# Altium schematic sheet TQP9111_Devboard_opt.SchDoc
size A4; SheetNumber: 4; SheetTotal: 4
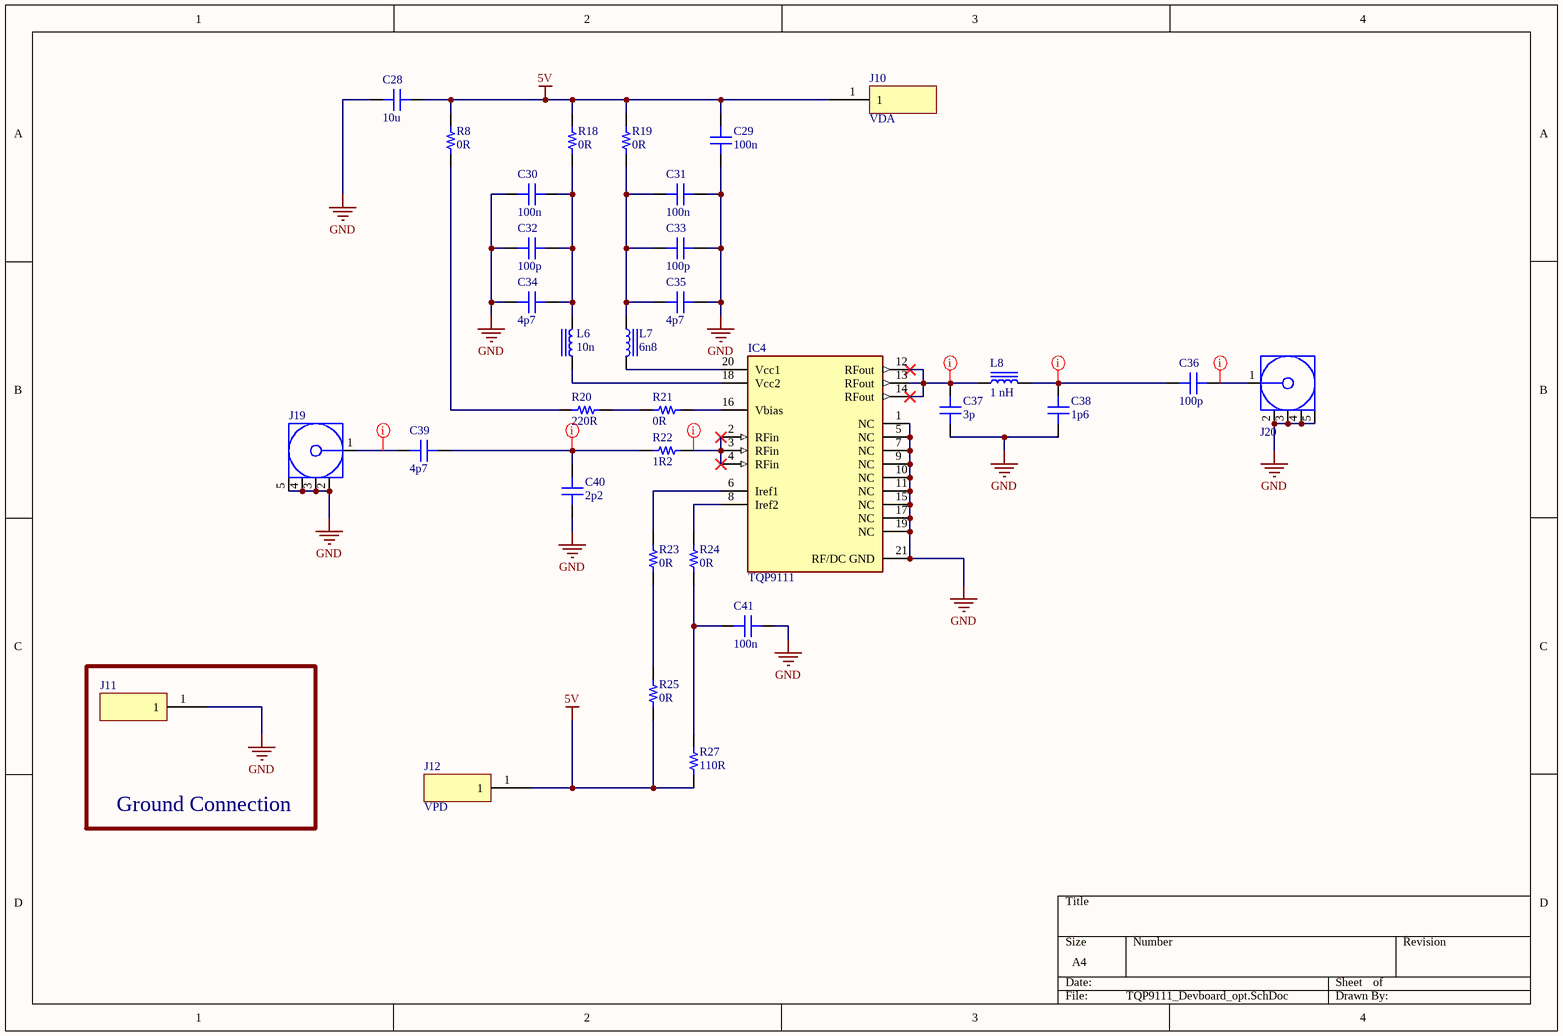
[diagram p0: TQP9111_Devboard_opt.SchDoc]

## Parts
C28  10u  [CAP 0805_2012]
C29  100n  [CAP 0603_1608]
C30  100n  [CAP 0603_1608]
C31  100n  [CAP 0603_1608]
C32  100p  [CAP 0603_1608 RF]
C33  100p  [CAP 0603_1608 RF]
C34  4p7  [CAP 0402_1005 RF]
C35  4p7  [CAP 0402_1005 RF]
C36  100p  [0603_SPECIAL]
C37  3p  [0402_special]  (mechanical)
C38  1p6  [0402_special]
C39  4p7  [0402_SPECIAL_3]
C40  2p2  [0402_special]
C41  100n  [CAP 0603_1608]
IC4  TQP9111  [FP-TQP9111-MFG]
J10  Nail_Head  [Nail_Head]  (value not drawn)
J11  Nail_Head  [Nail_Head]  (value not drawn)
J12  Nail_Head  [Nail_Head]  (value not drawn)
J19  60312202114513  [60312202114513]  (value not drawn)
J20  60312202114513  [60312202114513]  (value not drawn)
L6  10n  [IND 0603_1608 RF WW]
L7  6n8  [IND 0402_1005 RF WW]
L8  1 nH  [0402]
R8  0R  [RES 0603_1608]
R18  0R  [RES 0603_1608]
R19  0R  [RES 0603_1608]
R20  220R  [RES 0603_1608]
R21  0R  [RES 0603_1608]
R22  1R2  [0402_Special_2]
R23  0R  [RES 0603_1608]
R24  0R  [RES 0603_1608]
R25  0R  [RES 0603_1608]
R27  110R  [RES 0603_1608]

## Blocks framed on the sheet
Ground Connection: J11

## Nets
5V: C28.2 C29.2 J10.1 J12.1 R8.2 R18.2 R19.2 R25.1 R27.1
GND: C28.1 C29.1 C30.1 C31.2 C32.1 C33.2 C34.1 C35.2 C37.1 C38.1 C40.1 C41.2 IC4.1(NC) IC4.5(NC) IC4.7(NC) IC4.9(NC) IC4.10(NC) IC4.11(NC) IC4.15(NC) IC4.17(NC) IC4.19(NC) IC4.21(RF/DC_GND) J11.1 J19.2(GND) J19.3(GND) J19.4(GND) J19.5(GND) J20.2(GND) J20.3(GND) J20.4(GND) J20.5(GND)
NetC30_2: C30.2 C32.2 C34.2 L6.2 R18.1
NetC31_1: C31.1 C33.1 C35.1 L7.2 R19.1
NetC36_1: C36.1 C38.2 L8.2
NetC36_2: C36.2 J20.1(Signal)
NetC37_2: C37.2 IC4.12(RFout) IC4.13(RFout) IC4.14(RFout) L8.1
NetC39_1: C39.1 J19.1(Signal)
NetC39_2: C39.2 C40.2 R22.1
NetC41_1: C41.1 R24.1 R27.2
NetIC4_2: IC4.2(RFin) IC4.3(RFin) IC4.4(RFin) R22.2
NetIC4_6: IC4.6(Iref1) R23.2
NetIC4_8: IC4.8(Iref2) R24.2
NetIC4_16: IC4.16(Vbias) R21.1
NetIC4_18: IC4.18(Vcc2) L6.1
NetIC4_20: IC4.20(Vcc1) L7.1
NetR8_1: R8.1 R20.1
NetR20_2: R20.2 R21.2
NetR23_1: R23.1 R25.2

## Layout directives
net class CPWG_2: NetC36_1, NetC36_2, NetC37_2, NetC39_1, NetC39_2, NetIC4_2

## Notes on the sheet
- (near J10) VDA
- (near J12) VPD

## Library data of the parts
C28 = GRM21BR61H106KE43L: CAP CER 10UF 50V X5R 0805; Value: 10 µF; Part Number: GRM21BR61H106KE43L
C29-C31 C41 = C0603X104K5RAC3316: CAP CER 0603 0.1UF 50V X7R 10%; manufacturer: KEMET; Capacitance: 0.1 µF; Part Number: C0603X104K5RAC3316; Value: 100n; Applications: Automotive, Boardflex Sensitive; componentlink1description: Datasheet; componentlink1url: https://api.kemet.com/component-edge/download/datasheet/C0603X104K5RAC3316.pdf; componentlink2description: DigiKey Link; componentlink2url: https://www.digikey.com/en/products/detail/kemet/C0603X104K5RAC3316/10315788; Device Package: 0603 (1608 Metric); Features: Soft Termination; lastupdated: 26/04/2023 19:06:00; Lifecycle Status: Active; Minimum Order: 1; Mounting Type: Surface Mount, MLCC; Operating Temperature: -55°C ~ 125°C; Package / Case: 0603 (1608 Metric); packaging: TapeAndReel; partid: 11116; Part Status: Active; price: 0.02; Ratings: AEC-Q200; series: SMD Auto X7R VW80808; Size / Dimension: 0.063" L x 0.031" W (1.60mm x 0.80mm); Supplier 1: DigiKey; Supplier Part Number 1: 399-C0603X104K5RAC3316CT-ND; Temperature Coefficient: X7R; Thickness (Max): 0.037" (0.95mm); Tolerance: ±10%; Voltage - Rated: 50V
C32 C33 C36 = 600S101GW250XT: CAP CER 100PF 250V NP0 0603; manufacturer: American Technical Ceramics; Temperature Coefficient: C0G, NP0; Tolerance: ±2%; Part Number: 600S101GW250XT; Applications: RF, Microwave, High Frequency, Bypass, Decoupling; Capacitance: 100 pF; componentlink1description: Datasheet; componentlink1url: http://www.atceramics.com/UserFiles/600s.pdf; componentlink2description: DigiKey Link; componentlink2url: https://www.digikey.com/en/products/detail/american-technical-ceramics/600S101GW250XT/3908987; Device Package: 0603 (1608 Metric); Features: High Q, Low Loss, Ultra Low ESR; lastupdated: 08/02/2024 21:16:59; Lifecycle Status: Active; Minimum Order: 1; Mounting Type: Surface Mount, MLCC; Operating Temperature: -55°C ~ 125°C; Package / Case: 0603 (1608 Metric); packaging: TapeAndReel; partid: 2165; Part Status: Active; price: 0.66; series: ATC 600S; Size / Dimension: 0.063" L x 0.032" W (1.60mm x 0.81mm); Supplier 1: DigiKey; Supplier Part Number 1: 1284-1931-1-ND; Thickness (Max): 0.035" (0.89mm); value: 100 pF; Voltage - Rated: 250V
C34 C35 C39 = 600L4R7BT200T: CAP CER 4.7PF 200V C0G/NP0 0402; manufacturer: American Technical Ceramics; Temperature Coefficient: C0G, NP0; Tolerance: ±0.1pF; Part Number: 600L4R7BT200T; Applications: RF, Microwave, High Frequency, Bypass, Decoupling; Capacitance: 4.7 pF; componentlink1description: Datasheet; componentlink1url: http://www.atceramics.com/UserFiles/600l.pdf; componentlink2description: DigiKey Link; componentlink2url: https://www.digikey.com/en/products/detail/american-technical-ceramics/600L4R7BT200T/3905170; Device Package: 0402 (1005 Metric); Features: High Q, Low Loss, Ultra Low ESR; lastupdated: 08/02/2024 21:11:52; Lifecycle Status: Active; Minimum Order: 1; Mounting Type: Surface Mount, MLCC; Operating Temperature: -55°C ~ 125°C; Package / Case: 0402 (1005 Metric); packaging: TapeAndReel; partid: 546; Part Status: Active; price: 0.28; series: ATC 600L; Size / Dimension: 0.040" L x 0.020" W (1.02mm x 0.51mm); Supplier 1: DigiKey; Supplier Part Number 1: 1284-1129-1-ND; Thickness (Max): 0.024" (0.60mm); value: 4.7 pF; Voltage - Rated: 200V
C37 = 600L3R0AW200T: CAP CER 3PF 200V NP0 0402; manufacturer: American Technical Ceramics; Temperature Coefficient: C0G, NP0; Tolerance: ±0.05pF; Part Number: 600L3R0AW200T; Applications: RF, Microwave, High Frequency, Bypass, Decoupling; Capacitance: 3 pF; componentlink1description: Datasheet; componentlink1url: http://www.atceramics.com/UserFiles/600l.pdf; componentlink2description: DigiKey Link; componentlink2url: https://www.digikey.com/en/products/detail/american-technical-ceramics/600L3R0AW200T/3908948; Device Package: 0402 (1005 Metric); Features: High Q, Low Loss, Ultra Low ESR; lastupdated: 08/02/2024 21:11:49; Lifecycle Status: Active; Minimum Order: 1; Mounting Type: Surface Mount, MLCC; Operating Temperature: -55°C ~ 125°C; Package / Case: 0402 (1005 Metric); packaging: TapeAndReel; partid: 1331; Part Status: Active; price: 0.41; series: ATC 600L; Size / Dimension: 0.040" L x 0.020" W (1.02mm x 0.51mm); Supplier 1: DigiKey; Supplier Part Number 1: 478-12303-1-ND; Thickness (Max): 0.024" (0.60mm); value: 3 pF; Voltage - Rated: 200V
C38 = 600L1R6BT200T: CAP CER 1.6PF 200V NP0 0402; manufacturer: American Technical Ceramics; Temperature Coefficient: C0G, NP0; Tolerance: ±0.1pF; Part Number: 600L1R6BT200T; Applications: RF, Microwave, High Frequency, Bypass, Decoupling; Capacitance: 1.6 pF; componentlink1description: Datasheet; componentlink1url: http://www.atceramics.com/UserFiles/600l.pdf; componentlink2description: DigiKey Link; componentlink2url: https://www.digikey.com/en/products/detail/american-technical-ceramics/600L1R6BT200T/3908928; Device Package: 0402 (1005 Metric); Features: High Q, Low Loss, Ultra Low ESR; lastupdated: 08/02/2024 21:11:52; Lifecycle Status: Active; Minimum Order: 1; Mounting Type: Surface Mount, MLCC; Operating Temperature: -55°C ~ 125°C; Package / Case: 0402 (1005 Metric); packaging: TapeAndReel; partid: 537; Part Status: Active; price: 0.39; series: ATC 600L; Size / Dimension: 0.040" L x 0.020" W (1.02mm x 0.51mm); Supplier 1: DigiKey; Supplier Part Number 1: 1284-1866-1-ND; Thickness (Max): 0.024" (0.60mm); value: 1.6 pF; Voltage - Rated: 200V
C40 = 600L2R2BT200T: CAP CER 2.2PF 200V C0G/NP0 0402; manufacturer: American Technical Ceramics; Temperature Coefficient: C0G, NP0; Tolerance: ±0.1pF; Part Number: 600L2R2BT200T; Applications: RF, Microwave, High Frequency, Bypass, Decoupling; Capacitance: 2.2 pF; componentlink1description: Datasheet; componentlink1url: http://www.atceramics.com/UserFiles/600l.pdf; componentlink2description: DigiKey Link; componentlink2url: https://www.digikey.com/en/products/detail/american-technical-ceramics/600L2R2BT200T/3905162; Device Package: 0402 (1005 Metric); Features: High Q, Low Loss, Ultra Low ESR; lastupdated: 08/02/2024 21:11:48; Lifecycle Status: Active; Minimum Order: 1; Mounting Type: Surface Mount, MLCC; Operating Temperature: -55°C ~ 125°C; Package / Case: 0402 (1005 Metric); packaging: TapeAndReel; partid: 1591; Part Status: Active; price: 0.39; series: ATC 600L; Size / Dimension: 0.040" L x 0.020" W (1.02mm x 0.51mm); Supplier 1: DigiKey; Supplier Part Number 1: 1284-1120-1-ND; Thickness (Max): 0.024" (0.60mm); value: 2.2 pF; Voltage - Rated: 200V
IC4 = CMP-231850-000007-1: Amplifier, Power, 1.8 to 2.7 GHz, 29.8 dB, 32.5 dBm, SMT, 4 x 4 mm; RoHS Compliant: Yes
J10-J12 = Nail_Head: 1460-2-00-80-00-00-03-0 Mill-Max; Supplier 1: Farnell; Supplier Part Number 1: 3889056
J19 J20 = 60312202114513: WR-SMA Connector, PCB End Launch Jack, 6.35SQ Flange Flat Tab 1.6mm, DC~18GHz, 50Ohm; Manufacturer: Wurth Elektronik; Center Contact Diameter: 0.51 WIDE x 0.25 THK; Connector Type: SMA; Interface Type: MIL-STD-348; Manufacturer Part Number: 60312202114513; Category: Coaxial Connectors; Match Code: WR-SMA; ComponentLink1Description: Website Link; ComponentLink1URL: https://www.we-online.com/redexpert/article/60312202114513?ad; ComponentLink2Description: Datasheet Link; ComponentLink2URL: https://www.we-online.com/redexpert/spec/60312202114513?ad; Mount: End Launch; Operating Temperature Max: 165°C; Operating Temperature Min: -65°C; Packaging: Tray; Frequency Range: DC~18GHz; Gender: Jack; Impedance: 50Ohm; Orientation: Straight
L6 = LQW18AN10NG8ZD: FIXED IND 10NH 1.6A 52 MOHM; Manufacturer: Murata Electronics; DC Resistance (DCR): 52mOhm Max; Frequency - Self Resonant: 4.75GHz; Inductance Frequency - Test: 100MHz; Material - Core: Non-Magnetic; Q @ Freq: 38 @ 250MHz; Shielding: Unshielded; Tolerance: ±2%; Type: Wirewound; Part Number: LQW18AN10NG8ZD; ComponentLink1Description: Datasheet; ComponentLink1URL: https://search.murata.co.jp/Ceramy/image/img/P02/JELF243A-9133.pdf; ComponentLink2Description: DigiKey Link; ComponentLink2URL: http://digikey.com/product-detail/en/murata-electronics/LQW18AN10NG8ZD/490-15640-1-ND/6800305; Current Rating (Amps): 1.6A; Device Package: 0603 (1608 Metric); Height - Seated (Max): 0.039" (1.00mm); Inductance: 10nH; LastUpdated: 06/09/2020 11:05:21; Lifecycle Status: Active; Minimum Order: 1; Mounting Type: Surface Mount; Operating Temperature: -55°C ~ 125°C; Package / Case: 0603 (1608 Metric); Packaging: TapeAndReel; PartId: 1478; Part Status: Active; Price: 0.10; Ratings: AEC-Q200; Series: LQW18; Size / Dimension: 0.063" L x 0.031" W (1.60mm x 0.80mm); Supplier 1: DigiKey; Supplier Part Number 1: 490-15640-1-ND; Supplier Device Package: 0603 (1608 Metric); Value: 10nH
L7 = AISC-0402HP-6N8J-T: FIXED IND 6.8NH 1.4A 65 MOHM SMD; Manufacturer: Abracon LLC; DC Resistance (DCR): 65mOhm Max; Frequency - Self Resonant: 5.8GHz; Inductance Frequency - Test: 250 MHz; Material - Core: Ceramic; Q @ Freq: 25 @ 250MHz; Shielding: Unshielded; Tolerance: ±5%; Type: Drum Core, Wirewound; Part Number: AISC-0402HP-6N8J-T; ComponentLink1Description: Datasheet; ComponentLink1URL: https://abracon.com/Magnetics/inductors/AISC-0402HP.pdf; ComponentLink2Description: DigiKey Link; ComponentLink2URL: https://www.digikey.com/en/products/detail/abracon-llc/AISC-0402HP-6N8J-T/4215114; Current Rating (Amps): 1.4 A; Device Package: 0402 (1005 Metric); Height - Seated (Max): 0.024" (0.60mm); Inductance: 6.8 nH; LastUpdated: 26/04/2023 20:01:03; Lifecycle Status: Active; Minimum Order: 1; Mounting Type: Surface Mount; Operating Temperature: -40°C ~ 125°C; Package / Case: 0402 (1005 Metric); Packaging: TapeAndReel; PartId: 720; Part Status: Active; Price: 0.10; Series: AISC-0402HP; Size / Dimension: 0.039" L x 0.022" W (1.00mm x 0.55mm); Supplier 1: DigiKey; Supplier Part Number 1: 535-12227-1-ND; Supplier Device Package: 0402 (1005 Metric); Value: 6.8 nH
L8 = 744765010A: FIXED IND 1NH 1.36A 45 MOHM SMD; Manufacturer: Würth Elektronik; DC Resistance (DCR): 45mOhm Max; Frequency - Self Resonant: 6GHz; Inductance Frequency - Test: 250 MHz; Material - Core: Ceramic; Q @ Freq: 13 @ 250MHz; Shielding: Unshielded; Tolerance: ±0.2nH; Type: Drum Core, Wirewound; Part Number: 744765010A; ComponentLink1Description: Datasheet; ComponentLink1URL: https://katalog.we-online.de/pbs/datasheet/744765010A.pdf; ComponentLink2Description: DigiKey Link; ComponentLink2URL: https://www.digikey.com/en/products/detail/würth-elektronik/744765010A/1994068; Current Rating (Amps): 1.36 A; Device Package: 0402 (1005 Metric); Height - Seated (Max): 0.024" (0.60mm); Inductance: 1 nH; LastUpdated: 11/03/2024 07:55:48; Lifecycle Status: Active; Minimum Order: 1; Mounting Type: Surface Mount; Operating Temperature: -40°C ~ 125°C; Package / Case: 0402 (1005 Metric); Packaging: TapeAndReel; PartId: 685; Part Status: Active; Price: 0.27; Ratings: AEC-Q200; Series: WE-KI; Size / Dimension: 0.039" L x 0.022" W (1.00mm x 0.55mm); Supplier 1: DigiKey; Supplier Part Number 1: 732-1703-1-ND; Supplier Device Package: 0402 (1005 Metric); Value: 1 nH
R8 R18 R19 R21 R23-R25 = JR0603X26E: 0603 26 AMP JUMPER; Manufacturer: Ohmite; Power (Watts): 0.135W; Resistance: 0 Ohms; Part Number: JR0603X26E; Value: 0R; ComponentLink1Description: Datasheet; ComponentLink1URL: https://www.ohmite.com/assets/docs/res_jr.pdf?r=false; ComponentLink2Description: DigiKey Link; ComponentLink2URL: https://www.digikey.com/en/products/detail/ohmite/JR0603X26E/10233371; Composition: Metal Element; Device Package: 0603 (1608 Metric); Height - Seated (Max): 0.022" (0.55mm); LastUpdated: 12/04/2023 19:32:57; Lifecycle Status: Active; Minimum Order: 1; Number of Terminations: 2; Operating Temperature: -55°C ~ 150°C; Package / Case: 0603 (1608 Metric); Packaging: TapeAndReel; PartId: 6812; Part Status: Active; Price: 0.10; Series: JR; Size / Dimension: 0.063" L x 0.031" W (1.60mm x 0.80mm); Supplier 1: DigiKey; Supplier Part Number 1: JR0603X26ECT-ND; Supplier Device Package: 0603; Tolerance: Jumper
R20 = CPF0603B220RE1: RES SMD 220 OHM 0.1% 1/16W 0603; Manufacturer: TE Connectivity Passive Product; Power (Watts): 0.063W, 1/16W; Resistance: 220 Ohms; Temperature Coefficient: ±25ppm/°C; Part Number: CPF0603B220RE1; Value: 220R; ComponentLink1Description: Datasheet; ComponentLink1URL: https://www.te.com/commerce/DocumentDelivery/DDEController?Action=srchrtrv&DocNm=1773200&DocType=DS&DocLang=English; ComponentLink2Description: DigiKey Link; ComponentLink2URL: https://www.digikey.com/en/products/detail/te-connectivity-passive-product/CPF0603B220RE1/2381904; Composition: Thin Film; Device Package: 0603 (1608 Metric); Height - Seated (Max): 0.022" (0.55mm); LastUpdated: 26/04/2023 19:28:28; Lifecycle Status: Active; Minimum Order: 1; Number of Terminations: 2; Operating Temperature: -55°C ~ 155°C; Package / Case: 0603 (1608 Metric); Packaging: TapeAndReel; PartId: 5753; Part Status: Active; Price: 0.12; Series: CPF, Neohm; Size / Dimension: 0.061" L x 0.031" W (1.55mm x 0.80mm); Supplier 1: DigiKey; Supplier Part Number 1: A103065CT-ND; Supplier Device Package: 0603; Tolerance: ±0.1%
R22 = SR731ERTTP1R20F: RES 1.2 OHM 1% 1/6W 0402; Manufacturer: KOA Speer Electronics, Inc.; Power (Watts): 0.167W, 1/6W; Resistance: 1.2 Ohms; Temperature Coefficient: ±200ppm/°C; Part Number: SR731ERTTP1R20F; Value: 1R2; ComponentLink1Description: Datasheet; ComponentLink1URL: http://www.koaspeer.com/catimages/Products/SR73-RT/SR73-RT.pdf; ComponentLink2Description: DigiKey Link; ComponentLink2URL: https://www.digikey.com/en/products/detail/koa-speer-electronics-inc/SR731ERTTP1R20F/9916424; Composition: Thick Film; Device Package: 0402 (1005 Metric); Features: Anti-Sulfur, Automotive AEC-Q200, Current Sense, Moisture Resistant; Height - Seated (Max): 0.016" (0.40mm); LastUpdated: 09/02/2024 20:29:36; Lifecycle Status: Active; Minimum Order: 1; Number of Terminations: 2; Operating Temperature: -55°C ~ 155°C; Package / Case: 0402 (1005 Metric); Packaging: TapeAndReel; PartId: 16999; Part Status: Active; Price: 0.12; Ratings: AEC-Q200; Series: SR73-RT; Size / Dimension: 0.039" L x 0.020" W (1.00mm x 0.50mm); Supplier 1: DigiKey; Supplier Part Number 1: 2019-SR731ERTTP1R20FCT-ND; Supplier Device Package: 0402; Tolerance: ±1%
R27 = RN73H1JTTD1100B25: RES 110 OHM 0.1% 1/10W 0603; Manufacturer: KOA Speer Electronics, Inc.; Power (Watts): 0.1W, 1/10W; Resistance: 110 Ohms; Temperature Coefficient: ±25ppm/°C; Part Number: RN73H1JTTD1100B25; Value: 110R; ComponentLink2Description: DigiKey Link; ComponentLink2URL: https://www.digikey.com/en/products/detail/koa-speer-electronics-inc/RN73H1JTTD1100B25/10685623; Composition: Metal Film; Device Package: 0603 (1608 Metric); Features: Automotive AEC-Q200, Moisture Resistant; Height - Seated (Max): 0.022" (0.55mm); LastUpdated: 26/04/2023 19:26:31; Lifecycle Status: Active; Minimum Order: 1; Number of Terminations: 2; Operating Temperature: -55°C ~ 155°C; Package / Case: 0603 (1608 Metric); Packaging: TapeAndReel; PartId: 71509; Part Status: Active; Price: 0.09; Ratings: AEC-Q200; Series: RN73H; Size / Dimension: 0.063" L x 0.031" W (1.60mm x 0.80mm); Supplier 1: DigiKey; Supplier Part Number 1: 2019-RN73H1JTTD1100B25CT-ND; Supplier Device Package: 0603; Tolerance: ±0.1%